# Altium schematic sheet core.SchDoc: a_card
size A4; Author: 劉東輝; SheetNumber: 1; SheetTotal: 5; Unit: 核心板; Edition: V1.5
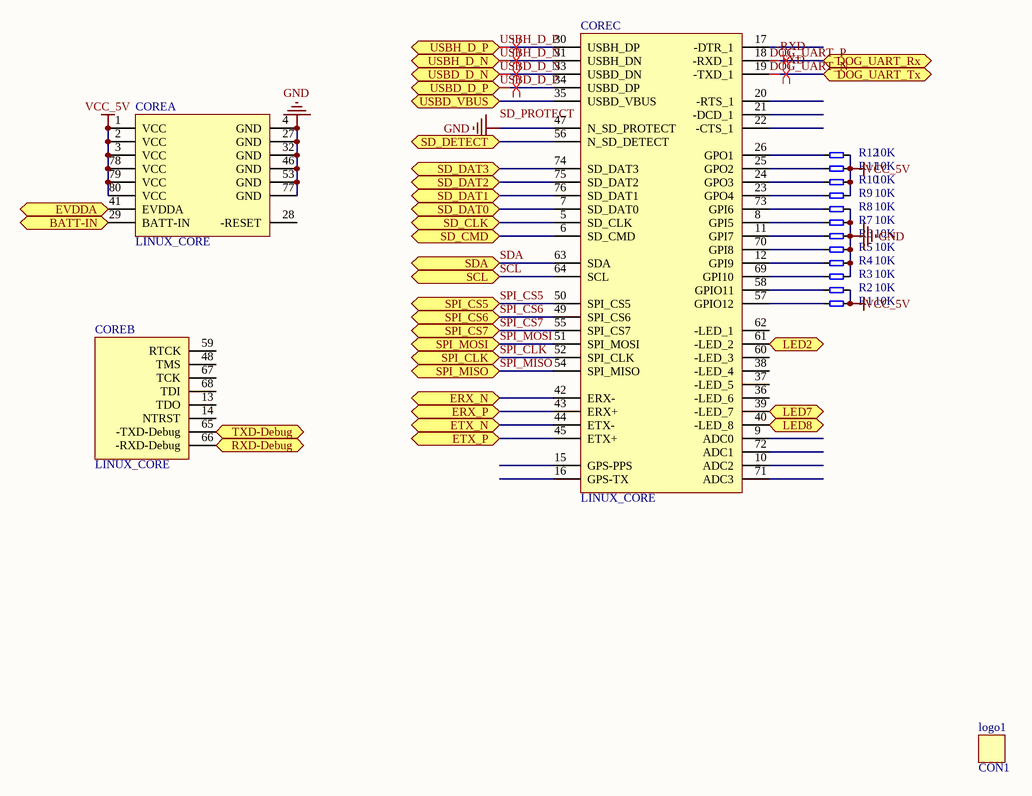
[diagram p0: core.SchDoc]

## Parts
CORE  LINUX_CORE  [LINUX_CORE]  (parts A,B,C of 3)
logo1  CON1  [logo]
R1  10K  [0805/2012 R3]
R2  10K  [0805/2012 R3]
R3  10K  [0805/2012 R3]
R4  10K  [0805/2012 R3]
R5  10K  [0805/2012 R3]
R6  10K  [0805/2012 R3]
R7  10K  [0805/2012 R3]
R8  10K  [0805/2012 R3]
R9  10K  [0805/2012 R3]
R10  10K  [0805/2012 R3]
R11  10K  [0805/2012 R3]
R12  10K  [0805/2012 R3]

## Ports
BATT-IN (bidir), DOG_UART_Rx (bidir), DOG_UART_Tx (bidir), ERX_N (bidir), ERX_P (bidir), ETX_N (bidir), ETX_P (bidir), EVDDA (bidir), LED2 (bidir), LED7 (bidir), LED8 (bidir), RXD-Debug (bidir), SCL (bidir), SD_CLK (bidir), SD_CMD (bidir), SD_DAT0 (bidir), SD_DAT1 (bidir), SD_DAT2 (bidir), SD_DAT3 (bidir), SD_DETECT (bidir), SDA (bidir), SPI_CLK (bidir), SPI_CS5 (bidir), SPI_CS6 (bidir), SPI_CS7 (bidir), SPI_MISO (bidir), SPI_MOSI (bidir), TXD-Debug (bidir), USBD_D_N (bidir), USBD_D_P (bidir), USBD_VBUS (bidir), USBH_D_N (bidir), USBH_D_P (bidir)

## Nets
GND: CORE.4(GND) CORE.27(GND) CORE.32(GND) CORE.46(GND) CORE.47(N_SD_PROTECT) CORE.53(GND) CORE.77(GND) R3.2 R4.2 R5.2 R6.2 R7.2 R8.2
VCC_5V: CORE.1(VCC) CORE.2(VCC) CORE.3(VCC) CORE.78(VCC) CORE.79(VCC) CORE.80(VCC) R1.2 R2.2 R9.2 R10.2 R11.2 R12.2
BATT-IN: CORE.29(BATT-IN) ; port BATT-IN
DOG_UART_N: CORE.19(-TXD_1) ; port DOG_UART_Tx
DOG_UART_P: CORE.18(-RXD_1) ; port DOG_UART_Rx
ERX_N: CORE.42(ERX-) ; port ERX_N
ERX_P: CORE.43(ERX+) ; port ERX_P
ETX_N: CORE.44(ETX-) ; port ETX_N
ETX_P: CORE.45(ETX+) ; port ETX_P
EVDDA: CORE.41(EVDDA) ; port EVDDA
LED2: CORE.61(-LED_2) ; port LED2
LED7: CORE.39(-LED_7) ; port LED7
LED8: CORE.40(-LED_8) ; port LED8
RXD-Debug: CORE.66(-RXD-Debug) ; port RXD-Debug
SCL: CORE.64(SCL) ; port SCL
SD_CLK: CORE.5(SD_CLK) ; port SD_CLK
SD_CMD: CORE.6(SD_CMD) ; port SD_CMD
SD_DAT0: CORE.7(SD_DAT0) ; port SD_DAT0
SD_DAT1: CORE.76(SD_DAT1) ; port SD_DAT1
SD_DAT2: CORE.75(SD_DAT2) ; port SD_DAT2
SD_DAT3: CORE.74(SD_DAT3) ; port SD_DAT3
SD_DETECT: CORE.56(N_SD_DETECT) ; port SD_DETECT
SDA: CORE.63(SDA) ; port SDA
SPI_CLK: CORE.52(SPI_CLK) ; port SPI_CLK
SPI_CS5: CORE.50(SPI_CS5) ; port SPI_CS5
SPI_CS6: CORE.49(SPI_CS6) ; port SPI_CS6
SPI_CS7: CORE.55(SPI_CS7) ; port SPI_CS7
SPI_MISO: CORE.54(SPI_MISO) ; port SPI_MISO
SPI_MOSI: CORE.51(SPI_MOSI) ; port SPI_MOSI
TXD-Debug: CORE.65(-TXD-Debug) ; port TXD-Debug
USBD_D_N: CORE.33(USBD_DN) ; port USBD_D_N
USBD_D_P: CORE.34(USBD_DP) ; port USBD_D_P
USBD_VBUS: CORE.35(USBD_VBUS) ; port USBD_VBUS
USBH_D_N: CORE.31(USBH_DN) ; port USBH_D_N
USBH_D_P: CORE.30(USBH_DP) ; port USBH_D_P
NetCORE_8: CORE.8(GPI5) R7.1
NetCORE_11: CORE.11(GPI7) R6.1
NetCORE_12: CORE.12(GPI9) R4.1
NetCORE_23: CORE.23(GPO4) R9.1
NetCORE_24: CORE.24(GPO3) R10.1
NetCORE_25: CORE.25(GPO2) R11.1
NetCORE_26: CORE.26(GPO1) R12.1
NetCORE_57: CORE.57(GPIO12) R1.1
NetCORE_58: CORE.58(GPIO11) R2.1
NetCORE_69: CORE.69(GPI10) R3.1
NetCORE_70: CORE.70(GPI8) R5.1
NetCORE_73: CORE.73(GPI6) R8.1

Not connected (* = marked no-connect by the designer): CORE 9(ADC0) 10(ADC2) 13(TDO) 14(NTRST) 15(GPS-PPS) 16(GPS-TX) 17(-DTR_1) 20(-RTS_1) 21(-DCD_1) 22(-CTS_1) 28(-RESET) 36(-LED_6) 37(-LED_5) 38(-LED_4) 48(TMS) 59(RTCK) 60(-LED_3) 62(-LED_1) 67(TCK) 68(TDI) 71(ADC3) 72(ADC1); logo1 1

## Layout directives
differential pair: DOG_UART_N, DOG_UART_P, USBD_D_N, USBD_D_P, USBH_D_N, USBH_D_P

## Notes on the sheet
- Labels drawn without touching a wire or pin: -RXD, -TXD, SD_PROTECT
- 项目:
- 作者:
- 总张数:
- 页码:
- 日期:
- 单元:
- 版本:

## Library data of the parts
logo1 = CON1: Connector
R1-R12 = RES2: Resistor